# EAGLE design gerbalino0.3.1 (EAGLE 7.4.0)
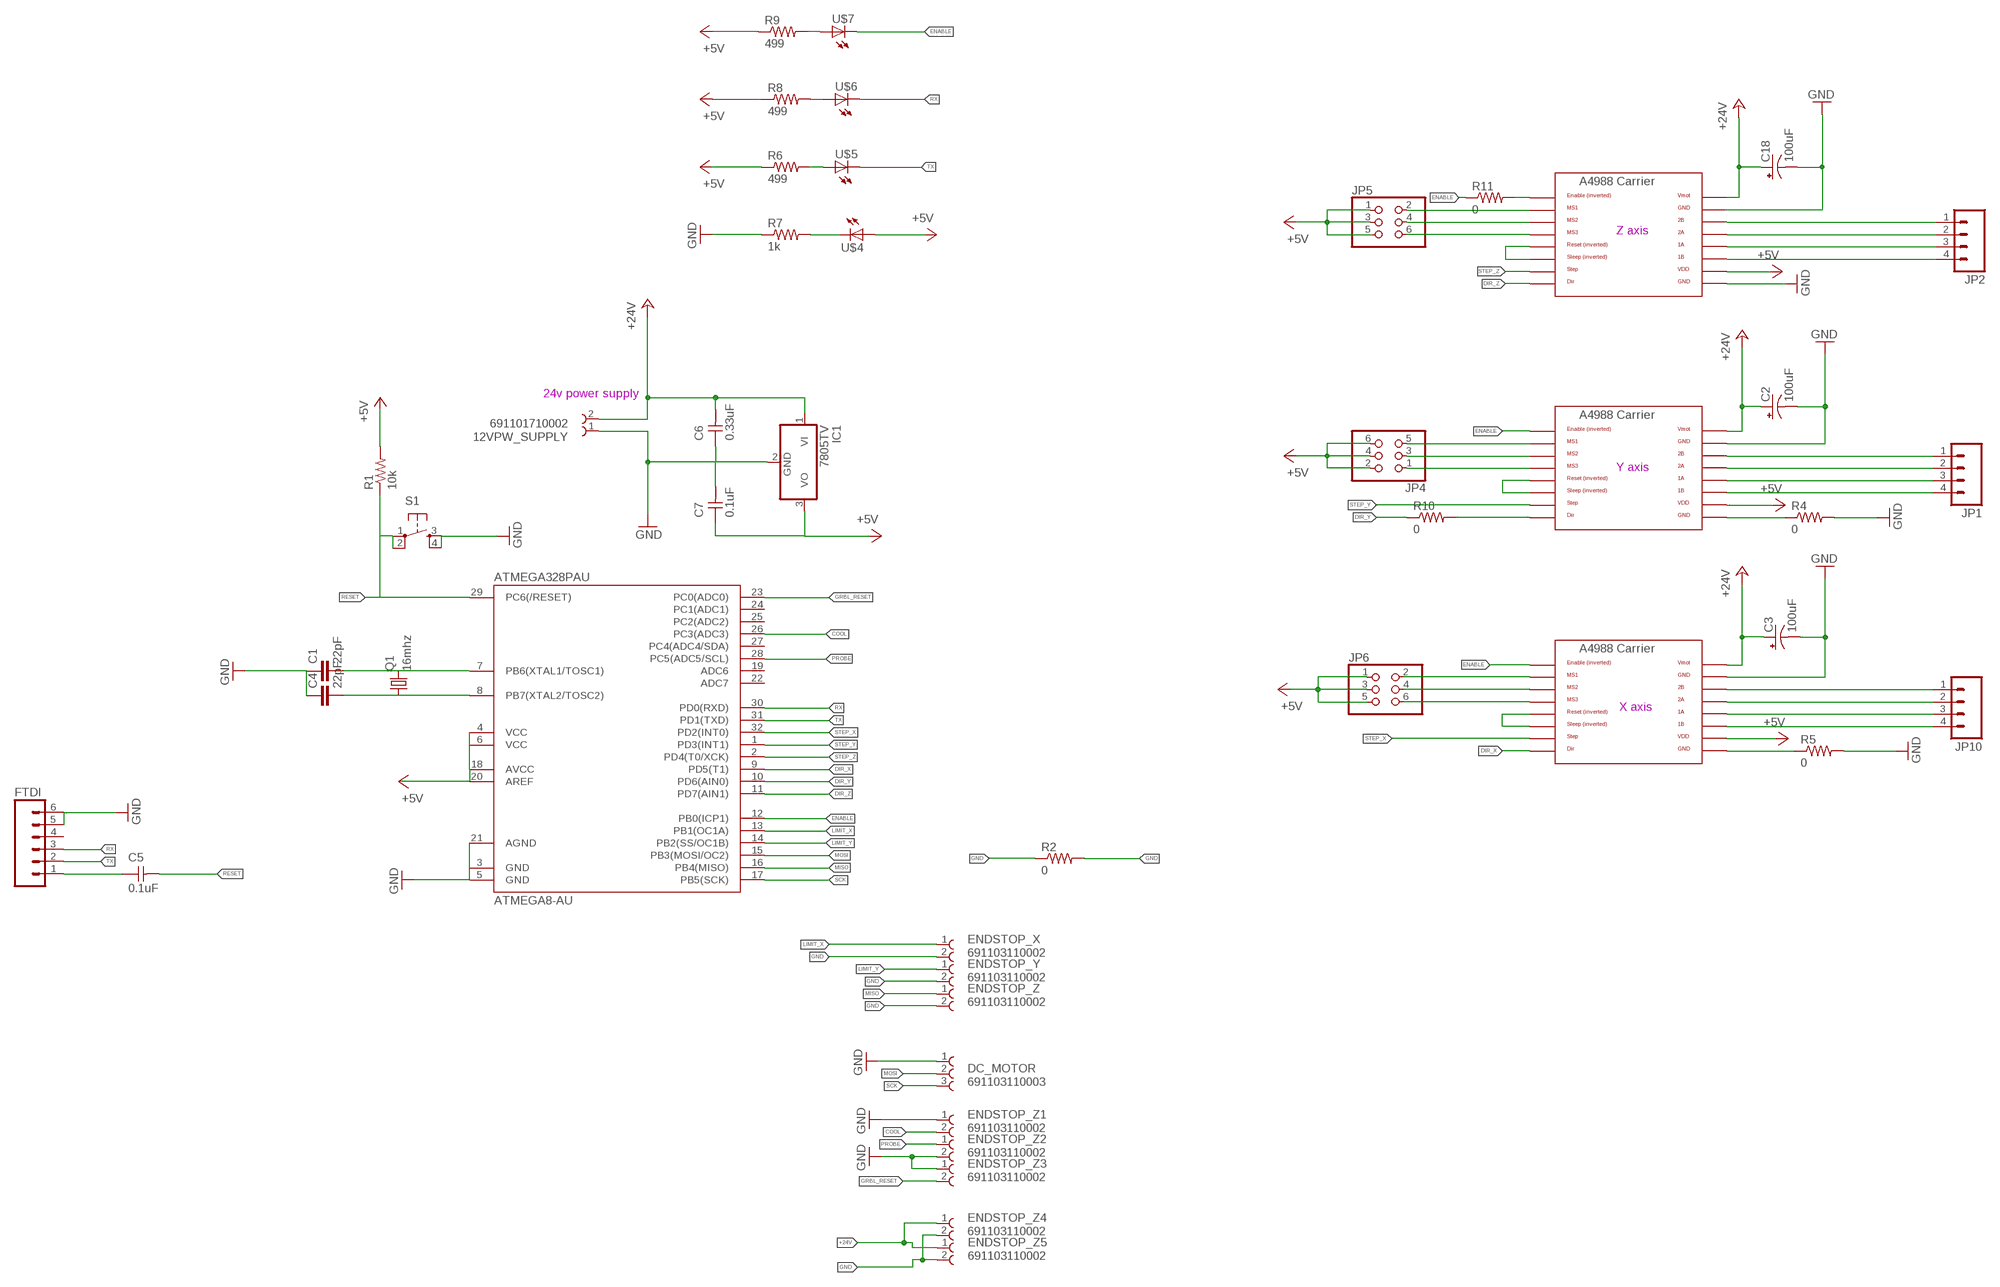
[diagram p0: schematic, sheet 1]

## Parts
12VPW_SUPPLY  691101710002  [691101710002]
ATMEGA328PAU  ATMEGA8-AU  [TQFP32-08]
C1  22pF  CAP1206  [1206]
C2  100uF  CPOL-USUD-10X10  [UD-10X10_NICHICON]
C3  100uF  CPOL-USUD-10X10  [UD-10X10_NICHICON]
C4  22pF  CAP1206  [1206]
C5  0.1uF  UNPOLARIZED_CAPACITOR1206  [1206]
C6  0.33uF  UNPOLARIZED_CAPACITOR1206  [1206]
C7  0.1uF  UNPOLARIZED_CAPACITOR1206  [1206]
C18  100uF  CPOL-USUD-10X10  [UD-10X10_NICHICON]
DC_MOTOR  691103110003  [691103110003]
ENDSTOP_X  691103110002  [691103110002]
ENDSTOP_Y  691103110002  [691103110002]
ENDSTOP_Z  691103110002  [691103110002]
ENDSTOP_Z1  691103110002  [691103110002]
ENDSTOP_Z2  691103110002  [691103110002]
ENDSTOP_Z3  691103110002  [691103110002]
ENDSTOP_Z4  691103110002  [691103110002]
ENDSTOP_Z5  691103110002  [691103110002]
FTDI  M06SMD  [1X06-SMD]
IC1  7805TV  [TO220V]
JP1  M04LONGPADS  [1X04_LONGPADS]
JP2  M04LONGPADS  [1X04_LONGPADS]
JP4  PINHD-2X3-SMD  [2X03SMD]
JP5  PINHD-2X3-SMD  [2X03SMD]
JP6  PINHD-2X3-SMD  [2X03SMD]
JP10  M04LONGPADS  [1X04_LONGPADS]
Q1  16mhz  CSM-7X-DU  [CSM-7X-DU]
R1  10k  RESISTOR1206  [1206]
R2  0  RESISTOR1206  [1206]
R4  0  RESISTOR1206  [1206]
R5  0  RESISTOR1206  [1206]
R6  499  RESISTOR1206  [1206]
R7  1k  RESISTOR1206  [1206]
R8  499  RESISTOR1206  [1206]
R9  499  RESISTOR1206  [1206]
R10  0  RESISTOR1206  [1206]
R11  0  RESISTOR1206  [1206]
S1  6MM_SWITCH6MM_SWITCH  [6MM_SWITCH]
U$1  POLOLU_A4983CARRIER  [A4988BREAKOUT]
U$2  POLOLU_A4983CARRIER  [A4988BREAKOUT]
U$3  POLOLU_A4983CARRIER  [A4988BREAKOUT]
U$4  LED1206  [1206]
U$5  LED1206  [1206]
U$6  LED1206  [1206]
U$7  LED1206  [1206]

## Nets
+5V [power]: ATMEGA328PAU.4(VCC) ATMEGA328PAU.6(VCC) ATMEGA328PAU.18(AVCC) ATMEGA328PAU.20(AREF) C7.1 IC1.3(VO) JP4.2 JP4.4 JP4.6 JP5.1 JP5.3 JP5.5 JP6.1 JP6.3 JP6.5 R1.2 R6.1 R8.1 R9.1 U$1.VDD U$2.VDD U$3.VDD U$4.1(A)
+24V: 12VPW_SUPPLY.2 C2.+ C3.+ C6.2 C18.+ ENDSTOP_Z4.1 ENDSTOP_Z5.1 IC1.1(VI) U$1.VMOT U$2.VMOT U$3.VMOT
COOL: ATMEGA328PAU.26(PC3(ADC3)) ENDSTOP_Z1.2
DIR_X: ATMEGA328PAU.9(PD5(T1)) U$3.DIR
DIR_Y: ATMEGA328PAU.10(PD6(AIN0)) R10.1
DIR_Z: ATMEGA328PAU.11(PD7(AIN1)) U$2.DIR
ENABLE: ATMEGA328PAU.12(PB0(ICP1)) R11.1 R11.2 U$1.EN U$2.EN U$3.EN U$7.2(C)
GND [power]: 12VPW_SUPPLY.1 ATMEGA328PAU.3(GND) ATMEGA328PAU.5(GND) ATMEGA328PAU.21(AGND) C1.1 C2.- C3.- C4.1 C6.1 C7.2 C18.- DC_MOTOR.1 ENDSTOP_X.2 ENDSTOP_Y.2 ENDSTOP_Z1.1 ENDSTOP_Z2.2 ENDSTOP_Z3.1 ENDSTOP_Z4.2 ENDSTOP_Z5.2 ENDSTOP_Z.2 FTDI.5 FTDI.6 IC1.2(GND) R2.1 R2.2 R4.1 R4.2 R5.1 R5.2 R7.1 S1.3(S) S1.4(S1) U$1.GND U$1.GND@0(GND) U$2.GND U$2.GND@0(GND) U$3.GND U$3.GND@0(GND)
GRBL_RESET: ATMEGA328PAU.23(PC0(ADC0)) ENDSTOP_Z3.2
LIMIT_X: ATMEGA328PAU.13(PB1(OC1A)) ENDSTOP_X.1
LIMIT_Y: ATMEGA328PAU.14(PB2(SS/OC1B)) ENDSTOP_Y.1
MISO: ATMEGA328PAU.16(PB4(MISO)) ENDSTOP_Z.1
MOSI: ATMEGA328PAU.15(PB3(MOSI/OC2)) DC_MOTOR.2
N$1: R7.2 U$4.2(C)
N$5: C5.1 FTDI.1
N$7: R8.2 U$6.1(A)
N$9: JP1.1 U$1.2B
N$10: JP1.2 U$1.2A
N$11: JP1.3 U$1.1A
N$12: JP1.4 U$1.1B
N$13: JP10.1 U$3.2B
N$14: JP10.2 U$3.2A
N$15: JP10.3 U$3.1A
N$16: JP10.4 U$3.1B
N$17: JP2.1 U$2.2B
N$18: JP2.2 U$2.2A
N$19: JP2.3 U$2.1A
N$20: JP2.4 U$2.1B
N$21: U$1.RST U$1.SLP(SLEEP)
N$22: U$3.RST U$3.SLP(SLEEP)
N$23: R9.2 U$7.1(A)
N$24: R10.2 U$1.DIR
N$25: R6.2 U$5.1(A)
N$28: U$2.RST U$2.SLP(SLEEP)
N$29: ATMEGA328PAU.8(PB7(XTAL2/TOSC2)) C4.2 Q1.1
N$30: JP5.6 U$2.MS3
N$31: JP5.4 U$2.MS2
N$32: JP5.2 U$2.MS1
N$33: JP4.1 U$1.MS3
N$34: JP4.3 U$1.MS2
N$35: JP4.5 U$1.MS1
N$36: JP6.6 U$3.MS3
N$37: JP6.4 U$3.MS2
N$38: JP6.2 U$3.MS1
N$39: ATMEGA328PAU.7(PB6(XTAL1/TOSC1)) C1.2 Q1.2
PROBE: ATMEGA328PAU.28(PC5(ADC5/SCL)) ENDSTOP_Z2.1
RESET: ATMEGA328PAU.29(PC6(/RESET)) C5.2 R1.1 S1.1(P) S1.2(P1)
RX: ATMEGA328PAU.30(PD0(RXD)) FTDI.3 U$6.2(C)
SCK: ATMEGA328PAU.17(PB5(SCK)) DC_MOTOR.3
STEP_X: ATMEGA328PAU.32(PD2(INT0)) U$3.STEP
STEP_Y: ATMEGA328PAU.1(PD3(INT1)) U$1.STEP
STEP_Z: ATMEGA328PAU.2(PD4(T0/XCK)) U$2.STEP
TX: ATMEGA328PAU.31(PD1(TXD)) FTDI.2 U$5.2(C)
Unconnected: ATMEGA328PAU.19(ADC6) ATMEGA328PAU.22(ADC7) ATMEGA328PAU.24(PC1(ADC1)) ATMEGA328PAU.25(PC2(ADC2)) ATMEGA328PAU.27(PC4(ADC4/SDA)) FTDI.4

## Notes on the sheet
- Z axis
- 24v power supply
- Y axis
- X axis

## Library data of the parts
12VPW_SUPPLY = Wurth_Elektronik_Electromechanic_Terminal_Blocks_Connectors_rev15d:691101710002: WR-TBL Serie 101 - 5.0mm HOrizontal Entry Modular with Pressure Clamp - 2.5mm2 Wires , 2 pins=>Code : Con-TBL_Screw_PressureClamp_691101710002 <http://katalog.we-online.de/media/images/eican/Con-TBL_Screw_PressureClamp_6911017100xx_pf2.jpg> Details see: http://katalog.we-online.de/en/em/691_101_710_0xx Created 2014-06-16, Karrer Zheng 2014 (C) Würth Elektronik
ATMEGA328PAU = 01_atmega8:ATMEGA8
C1 C4 = 01_SparkFun:CAP: Capacitor Standard 0603 ceramic capacitor, and 0.1" leaded capacitor.
C2 C3 C18 = rcl:CPOL-US: POLARIZED CAPACITOR, American symbol
C5-C7 = 01_FAB_Hello:UNPOLARIZED_CAPACITOR: unpolarized_capacitor
DC_MOTOR = Wurth_Elektronik_Electromechanic_Terminal_Blocks_Connectors_rev15d:691103110003: WR-TBL Serie 1031 - 3.5mm Horizontal Entry Modular with Pressure Clamp - 1.5mm2 Wires, 3 Pins=>Code : Con_TBL_Screw_PressureClamp_6911103110003 <http://katalog.we-online.de/media/images/eican/Con_TBL_Screw_PressureClamp_69111031100xx_pf2.jpg> Details see: http://katalog.we-online.de/en/em/691_103_110_0xx Created 2014-06-16, Karrer Zheng 2014 (C) Würth Elektronik
ENDSTOP_X ENDSTOP_Y ENDSTOP_Z ENDSTOP_Z1-ENDSTOP_Z5 = Wurth_Elektronik_Electromechanic_Terminal_Blocks_Connectors_rev15d:691103110002: WR-TBL Serie 1031 - 3.5mm Horizontal Entry Modular with Pressure Clamp - 1.5mm2 Wires, 2 Pins=>Code : Con_TBL_Screw_PressureClamp_6911103110002 <http://katalog.we-online.de/media/images/eican/Con_TBL_Screw_PressureClamp_69111031100xx_pf2.jpg> Details see: http://katalog.we-online.de/en/em/691_103_110_0xx Created 2014-06-16, Karrer Zheng 2014 (C) Würth Elektronik
FTDI = 01_SparkFun:M06: Header 6 Standard 6-pin 0.1" header. Use with straight break away headers (SKU : PRT-00116), right angle break away headers (PRT-00553), swiss pins (PRT-00743), machine pins (PRT-00117), and female headers (PRT-00115). Molex polarized connector foot print use with SKU : PRT-08094 with associated crimp pins and housings. NOTES ON THE VARIANTS LOCK and LOCK_LONGPADS... This footprint was designed to help hold the alignment of a through-hole component (i.e. 6-pin header) while soldering it into place. You may notice that each hole has been shifted either up or down by 0.005 of an inch from it's more standard position (which is a perfectly straight line). This slight alteration caused the pins (the squares in the middle) to touch the edges of the holes. Because they are alternating, it causes a "brace" to hold the component in place. 0.005 has proven to be the perfect amount of "off-center" position when using our standard breakaway headers. Although looks a little odd when you look at the bare footprint, once you have a header in there, the alteration is very hard to notice. Also, if you push a header all the way into place, it is covered up entirely on the bottom side. This idea of altering the position of holes to aid alignment will be further integrated into the Sparkfun Library for other footprints. It can help hold any component with 3 or more connection pins.
IC1 = linear:78*: Positive VOLTAGE REGULATOR Source: http://cache.national.com/ds/LM/LM78L05.pdf http://www.fairchildsemi.com/ds/LM/LM7805.pdf
JP1 JP2 JP10 = 01_SparkFun:M04: Header 4 Standard 4-pin 0.1" header. Use with straight break away headers (SKU : PRT-00116), right angle break away headers (PRT-00553), swiss pins (PRT-00743), machine pins (PRT-00117), and female headers (PRT-00115). Molex polarized connector foot print use with SKU : PRT-08231 with associated crimp pins and housings.
JP4-JP6 = 01_FAB_Hello:PINHD-2X3-SMD: PIN HEADER
Q1 = crystal:CSM-7X-DU: SMD CRYSTAL Source: www.ecsxtal.com .. Crystal 3.6864MHz CSM_7X_DU.PDF; OC_FARNELL: unknown; OC_NEWARK: unknown
R1 R2 R4 R5 R10 R11 = 01_SparkFun:RESISTOR: Resistor Basic schematic elements and footprints for 0603, 1206, and PTH 1/10th watt (small) resistors.
R6-R9 = 01_FAB_Hello:RESISTOR
S1 = 01_FAB_Hello:6MM_SWITCH: OMRON SWITCH
U$1-U$3 = RepRapjr:POLOLU_A4983CARRIER
U$4-U$7 = 01_FAB_Hello:LED

## Net classes
0 default: width 0.203 mm, clearance 0.203 mm
1 power: width 0.305 mm, clearance 0.203 mm

## Board
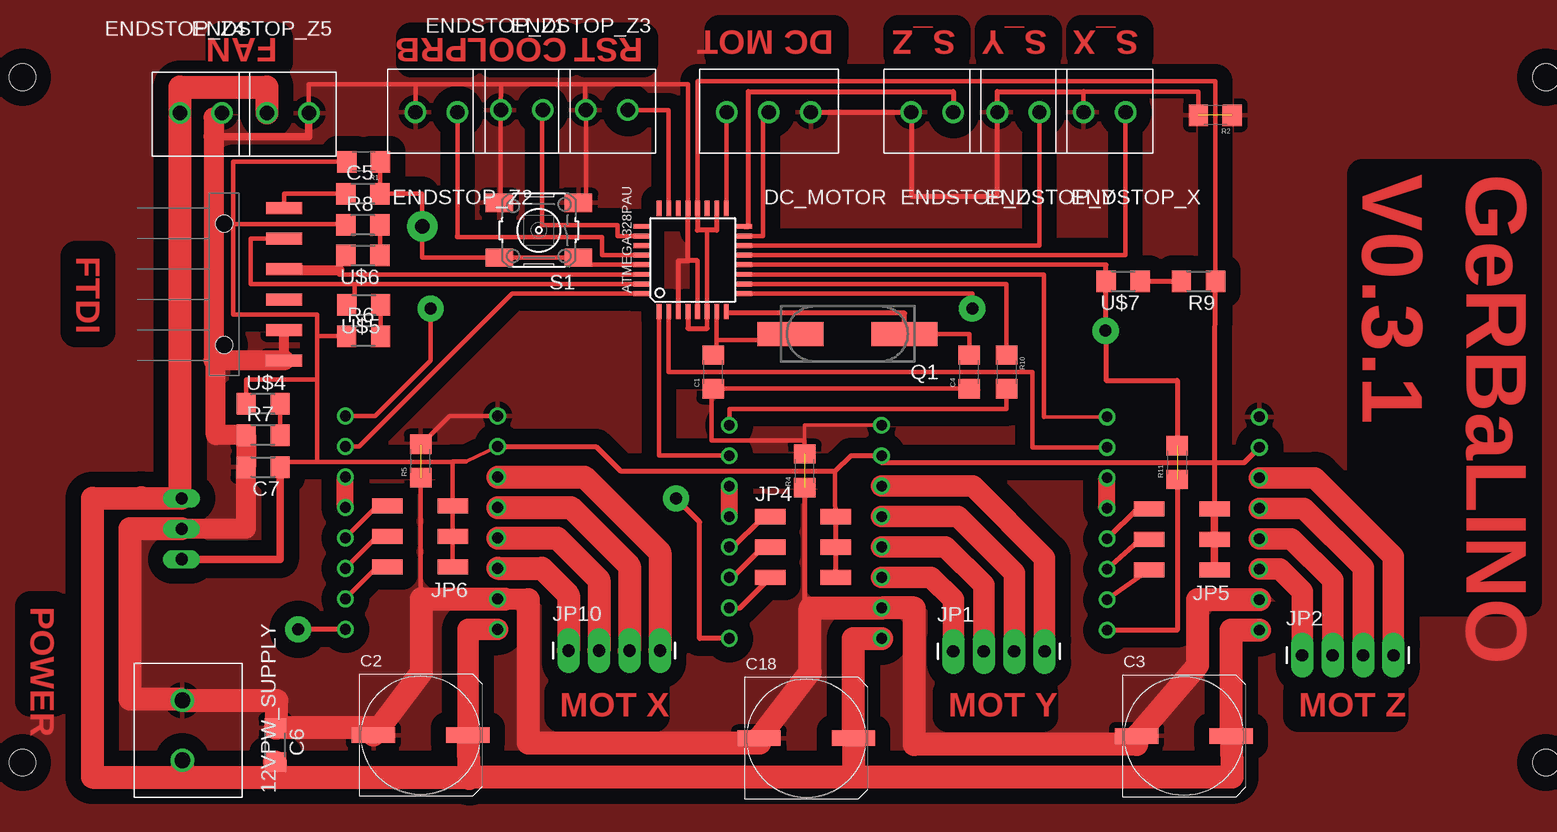
[diagram p1: board, top side]
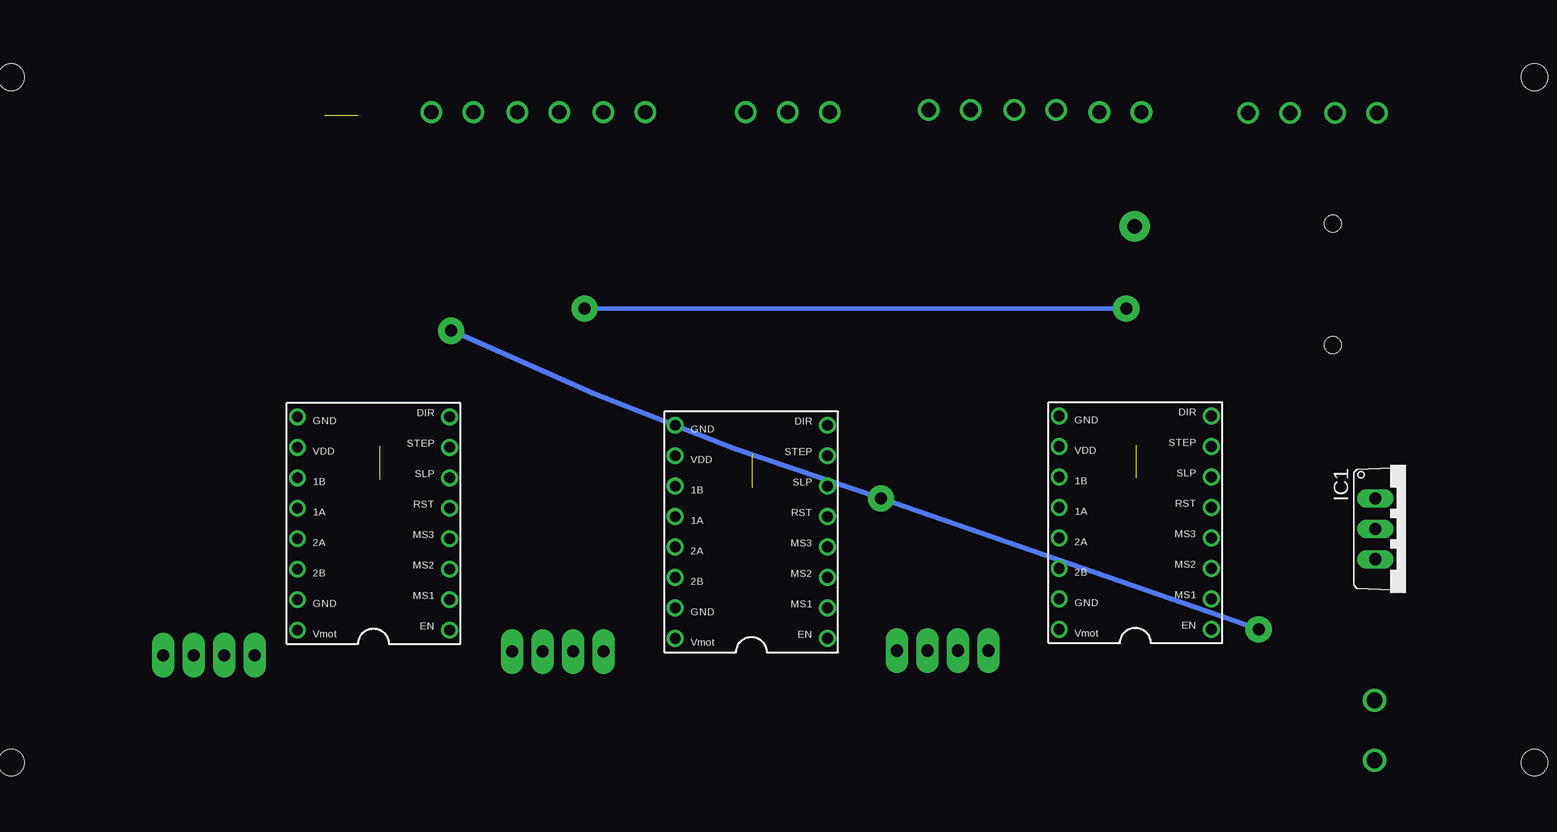
[diagram p2: board, bottom side, seen from below]

No outline drawn. Coordinates in mm, seen from the top.
Copper layers (1*16): Top 0.035mm / dielectric 1.5mm / Bottom 0.035mm
Design rules "default *": minimum track width 8mil, minimum drill 16mil, track to track 8mil, track to pad 8mil, pad to pad 8mil, via to via 8mil, smd to smd 8mil, copper to edge 30mil, drill to drill 10mil, minimum pad ring 10mil, minimum via ring 12mil, stop-mask expansion 4mil, vias tented up to drill 0mil, thermal gap 20mil
Holes 2.2 mm at -12.7,57.15 -12.7,0 114.3,57.15 114.3,0

### Footprints (pad centres in the part's own frame; a part is rotated, then mirrored left to right if it is on the bottom)
691101710002 = drill 1.3: 1 -5,0; 2 0,0
TQFP32-08 = smd 1.27 x 0.406: 1 -4.293,2.8; 2 -4.293,2; 3 -4.293,1.2; 4 -4.293,0.4; 5 -4.293,-0.4; 6 -4.293,-1.2; 7 -4.293,-2; 8 -4.293,-2.8; 17 4.293,-2.8; 18 4.293,-2; 19 4.293,-1.2; 20 4.293,-0.4; 21 4.293,0.4; 22 4.293,1.2; 23 4.293,2; 24 4.293,2.8 | smd 0.406 x 1.27: 9 -2.8,-4.293; 10 -2,-4.293; 11 -1.2,-4.293; 12 -0.4,-4.293; 13 0.4,-4.293; 14 1.2,-4.293; 15 2,-4.293; 16 2.8,-4.293; 25 2.8,4.293; 26 2,4.293; 27 1.2,4.293; 28 0.4,4.293; 29 -0.4,4.293; 30 -1.2,4.293; 31 -2,4.293; 32 -2.8,4.293
1206 = smd 1.6 x 1.8: 1 -1.4,0; 2 1.4,0
UD-10X10_NICHICON = smd 3.6 x 1.3: + 3.925,0; - -3.95,0
1206' = smd 1.6 x 1.803: 1 -1.422,0; 2 1.422,0
691103110003 = drill 1.2: 1 -3.5,0; 2 0,0; 3 3.5,0
691103110002 = drill 1.2: 1 -3.5,0; 2 0,0
1X06-SMD = smd 1 x 3: 1 -6.35,5; 2 -3.81,5; 3 -1.27,5; 4 1.27,5; 5 3.81,5; 6 6.35,5 | hole 1.4: -5.08,0; 5.08,0
TO220V = drill 1.016 long: 1 -2.54,-2.54; 2 0,-2.54; 3 2.54,-2.54
1X04_LONGPADS = drill 1.016 pad 1.88 long: 1 0,0; 2 2.54,0; 3 5.08,0; 4 7.62,0
2X03SMD = smd 2.54 x 1.27: 1 -2.54,2.54; 2 2.92,2.54; 3 -2.54,0; 4 2.92,0; 5 -2.54,-2.54; 6 2.92,-2.54
CSM-7X-DU = smd 5.5 x 2: 1 -4.75,0; 2 4.75,0
6MM_SWITCH = smd 2.286 x 1.524: 1 -3.302,2.286; 2 3.302,2.286; 3 -3.302,-2.286; 4 3.302,-2.286
A4988BREAKOUT = drill 0.9: 1A 8.89,1.27; 1B 11.43,1.27; 2A 6.35,1.27; 2B 3.81,1.27; DIR 16.51,-11.43; EN -1.27,-11.43; GND 16.51,1.27; GND@0 1.27,1.27; MS1 1.27,-11.43; MS2 3.81,-11.43; MS3 6.35,-11.43; RST 8.89,-11.43; SLP 11.43,-11.43; STEP 13.97,-11.43; VDD 13.97,1.27; VMOT -1.27,1.27

### Placement (x,y rotation side)
12VPW_SUPPLY  0.64,0.19 270 top
ATMEGA328PAU  43.18,41.91 90 top
C1  44.89,32.58 90 top
C2  20.51,2.29 0 top
C3  84.14,2.22 0 top
C4  66.23,32.58 90 top
C5  0.1uF  [1206']  15.68,47.43 0 top
C6  0.33uF  [1206']  8.38,1.46 270 top
C7  0.1uF  [1206']  7.37,24.64 180 top
C18  52.65,2.03 0 top
DC_MOTOR  49.53,54.23 180 top
ENDSTOP_X  75.76,54.23 180 top
ENDSTOP_Y  68.58,54.23 180 top
ENDSTOP_Z  61.4,54.23 180 top
ENDSTOP_Z1  30.67,54.42 0 top
ENDSTOP_Z2  20.07,54.23 180 top
ENDSTOP_Z3  37.78,54.42 0 top
ENDSTOP_Z4  3.94,54.17 0 top
ENDSTOP_Z5  11.18,54.17 0 top
FTDI  4.13,39.88 270 top
IC1  -1.97,19.49 270 bottom
JP1  64.9,9.27 0 top
JP2  93.98,8.95 0 top
JP4  52.2,17.97 0 top
JP5  84.14,18.61 180 top
JP6  20.64,18.86 180 top
JP10  32.83,9.33 0 top
Q1  56.07,35.75 180 top
R1  15.75,50.1 180 top
R2  86.74,53.98 180 top
R4  52.51,24.32 90 top
R5  20.51,25.15 90 top
R6  499  [1206']  15.75,35.56 0 top
R7  1k  [1206']  7.37,27.3 0 top
R8  499  [1206']  15.68,44.83 0 top
R9  499  [1206']  85.34,40.13 180 top
R10  69.34,32.58 270 top
R11  83.57,25.02 90 top
S1  30.35,44.39 180 top
U$1  57.66,11.62 90 bottom
U$2  89.15,12.32 90 bottom
U$3  25.65,12.38 90 bottom
U$4  [1206']  7.37,29.91 0 top
U$5  [1206']  15.75,38.16 180 top
U$6  [1206']  15.68,42.29 180 top
U$7  [1206']  79.06,40.13 180 top

### Tracks (layer width: path | path; a pad name or v marks a point on that pad's centre or on a via)
+5V
  Top 0.305: ATMEGA328PAU.6 | 23.05,25.08 24.27,25.12 U$3.VDD
  Top 0.356: 44.38,36.2 ATMEGA328PAU.6 | ATMEGA328PAU.6 44.39,44.39 | ATMEGA328PAU.20 43.58,56.83 86.77,56.83 R9.1 | 11.88,25.09 11.87,29.21 11.87,31.94 | 23.05,25.08 12.39,25.08 11.88,25.09 | 11.87,31.94 11.87,35.56 | 11.87,35.56 11.87,37.34 4.89,37.34 4.89,44.9 | 4.89,44.9 4.89,50.1 R1.2 | JP6.1 JP6.3 JP6.5 23.18,25.12 24.27,25.12 | JP4.2 55.05,21.59 55.05,24.32 | R6.1 11.87,35.56 | R8.1 14.26,44.9 4.89,44.9 | 11.88,25.09 8.79,25.09 C7.1 | U$4.1 5.94,31.94 11.87,31.94
  Top 0.406: JP4.6 JP4.4 JP4.2 | ATMEGA328PAU.4 42.78,36.2 44.38,36.2 | ATMEGA328PAU.18 45.18,44.39 44.39,44.39 43.58,44.39 ATMEGA328PAU.20 | U$3.VDD 35.12,26.35 37.15,24.32 55.05,24.32 56.39,25.59 U$1.VDD 58.93,25.02 86.68,25.02 | 86.68,25.02 89.15,25.02 U$2.VDD | 86.68,25.02 JP5.5 | R9.1 86.7,39.81 86.68,33.08 86.68,25.02
  Top 0.61: JP5.1 JP5.3 JP5.5 | C7.1 8.79,16.95 IC1.3
+24V
  Top 1.778: C2.+ 24.44,11.1 U$3.VMOT | -2.6,22 -2.79,22.07
  Top 1.93: C2.+ 24.56,-1.34 24.45,-1.21 | 56.58,-1.21 C18.+ 56.58,10.35 U$1.VMOT | 56.58,-1.21 24.45,-1.21 | 56.58,-1.21 88.13,-1.21 C3.+ 88.06,11.05 U$2.VMOT | IC1.1 -2.79,22.07 -6.86,22.04 -6.86,-1.21 0.64,-1.21 | 0.64,-1.21 8.45,-1.21 | 8.45,-1.21 24.45,-1.21 | 12VPW_SUPPLY.2 0.64,-1.21 | 8.45,-1.15 8.45,-1.21 | C6.2 8.32,0.04 8.45,-1.21 | IC1.1 0.45,22.04 | ENDSTOP_Z5.1 7.68,56.33 0.44,56.33 ENDSTOP_Z4.1 0.44,22.04 IC1.1
COOL
  Top 0.356: ATMEGA328PAU.26 36.89,43.91 36.89,44.83 30.61,44.83 30.61,54.04 30.67,53.85 ENDSTOP_Z1.2
DIR_X  (via drill 1 pad 2.18)
  Top 0.305: 47.94,39.11 ATMEGA328PAU.9
  Top 0.356: v66.48,37.85 66.48,39.11 ATMEGA328PAU.9 | U$3.DIR 16.7,28.89 21.34,33.53 v21.34,37.85
  Bottom 0.356: v21.34,37.85 v66.48,37.85
DIR_Y
  Top 0.356: ATMEGA328PAU.10 69.34,39.91 R10.1
DIR_Z
  Top 0.305: U$2.DIR 72.45,28.83
  Top 0.356: 72.45,28.83 72.45,40.71 ATMEGA328PAU.11
ENABLE  (via drill 1 pad 2.18)  (1 unrouted)
  Top 0.356: ATMEGA328PAU.12 77.64,41.51
  Top 0.406: U$1.EN 43.75,10.35 43.75,20.07 v41.78,22.04 | U$3.EN v10.29,11.11 | 77.64,36.01 77.64,31.88 83.57,31.88 R11.2 | v77.6,36.01 77.64,36.01 | U$2.EN 83.57,11.05 R11.1 | 77.64,36.01 U$7.2 77.64,41.51
  Bottom 0.406: v10.29,11.11 v41.78,22.04 arc8 v77.6,36.01
GND  (3 unrouted)
  Top 0.305: 42.8,46.2 ATMEGA328PAU.21 | 52.51,26.86 52.51,28.13 U$1.GND | 20.51,26.48 R5.2
  Top 0.356: ATMEGA328PAU.5 43.58,41.85 | 34.23,56.58 27.19,56.58 | 27.19,56.58 20.07,56.58 | ATMEGA328PAU.21 42.78,56.58 34.23,56.58 | 34.23,56.58 34.16,54.17 ENDSTOP_Z3.1 34.28,46.74 S1.3 | 27.43,46.8 S1.4 27.17,46.86 ENDSTOP_Z1.1 27.19,56.58 | 20.07,56.58 11.18,56.58 ENDSTOP_Z5.2 | 20.07,56.58 ENDSTOP_Z2.2 | R4.2 52.51,26.86 44.76,26.86 44.76,31.18 C1.1 C4.1 | 20.57,13.64 20.51,13.64 R5.1 | 20.51,26.48 22.92,28.89 U$3.GND | ENDSTOP_X.2 75.75,55.94 85.34,55.94 85.34,55.88 R2.2
  Top 0.406: 43.58,41.85 42.8,41.85 | ATMEGA328PAU.3 41.98,41.85 42.8,41.85 | 42.8,41.85 42.8,46.2 | 20.56,13.65 20.51,13.65 | R4.1 52.51,12.89 54.42,12.89 | U$2.GND 90.42,28.77 | 75.75,55.94 68.58,55.94 ENDSTOP_Y.2 68.58,47.24 61.4,47.24 ENDSTOP_Z.2 DC_MOTOR.1
  Top 0.61: ENDSTOP_Z4.2 3.24,53.78 | ENDSTOP_Z5.2 11.18,52.2 3.24,52.2
  Top 0.813: FTDI.6 FTDI.5 | 5.97,27.3 R7.1 | 3.24,33.53 3.43,33.53
  Top 1.676: FTDI.6 3.24,33.53 3.24,52.2 3.24,53.78 | IC1.2 5.94,19.49 C7.2 R7.1 3.43,27.3 3.43,33.53
  Top 1.778: U$3.GND@0 27.5,13.64 29.46,13.59
  Top 1.93: 29.46,13.59 29.46,1.65 48.77,1.65 C18.- 52.96,7.55 52.96,12.89 54.42,12.89 U$1.GND@0 61.66,12.89 61.66,1.52 80.19,1.52 C3.- 85.28,8.14 85.28,13.59 U$2.GND@0 | IC1.2 -3.75,19.49 -3.75,5.29 0.45,5.29 12VPW_SUPPLY.1 8.51,5.19 8.51,2.88 C6.1 16.56,2.88 C2.- 20.56,7.56 20.56,13.65 20.57,13.64 27.5,13.64
  pour Top (isolate 1.27): -19.05,63.5 120.65,63.5 120.65,-6.35 -19.05,-6.35
GRBL_RESET
  Top 0.356: ENDSTOP_Z3.2 41.18,54.42 ATMEGA328PAU.23
LIMIT_X
  Top 0.356: ATMEGA328PAU.13 79.25,42.31 ENDSTOP_X.1
LIMIT_Y
  Top 0.356: ATMEGA328PAU.14 72.07,43.11 72.07,44.95 ENDSTOP_Y.1
MISO
  Top 0.406: ENDSTOP_Z.1 64.9,55.94 47.82,55.94 47.82,44.71 ATMEGA328PAU.16
MOSI
  Top 0.356: ATMEGA328PAU.15 49.02,43.91 49.02,54.1 DC_MOTOR.2
N$1
  Top 0.356: R7.2 U$4.2
N$5
  Top 0.356: FTDI.1 9.13,47.43 C5.1
N$7
  Top 0.356: U$6.1 R8.2
N$9
  Top 1.778: U$1.2B 63.06,15.43 64.9,13.59 JP1.1
N$10
  Top 1.778: U$1.2A 64.26,17.97 67.44,14.8 JP1.2
N$11
  Top 1.778: U$1.1A 65.28,20.51 69.98,15.81 JP1.3
N$12
  Top 1.778: U$1.1B 66.55,23.05 72.52,17.08 JP1.4
N$13
  Top 1.93: U$3.2B 30.61,16.19 32.83,13.97 JP10.1
N$14
  Top 1.93: U$3.2A 31.88,18.73 35.37,15.24 JP10.2
N$15
  Top 1.93: U$3.1A 33.02,21.27 37.91,16.38 JP10.3
N$16
  Top 1.93: U$3.1B 34.16,23.81 40.45,17.53 JP10.4
N$17
  Top 1.778: U$2.2B 92.14,16.13 93.98,14.29 JP2.1
N$18
  Top 1.778: U$2.2A 93.09,18.67 96.52,15.24 JP2.2
N$19
  Top 1.778: U$2.1A 94.11,21.21 99.06,16.26 JP2.3
N$20
  Top 1.778: U$2.1B 95.06,23.75 101.6,17.21 JP2.4
N$21
  Top 1.422: U$1.RST U$1.SLP
N$22
  Top 1.422: U$3.RST U$3.SLP
N$23
  Top 0.406: U$7.1 R9.2
N$24
  Top 0.356: U$1.DIR 46.23,29.46 69.34,29.46 R10.2
N$25
  Top 0.356: U$5.1 R6.2
N$28
  Top 1.422: U$2.RST U$2.SLP
N$29
  Top 0.356: 45.98,37.47 ATMEGA328PAU.8 | Q1.1 66.23,35.75 C4.2
  Top 0.406: Q1.1 60.83,37.47 45.98,37.47
N$30
  Top 0.406: U$2.MS3 80.39,21.27 JP5.6
N$31
  Top 0.406: U$2.MS2 80.71,18.8 JP5.4
N$32
  Top 0.406: U$2.MS1 JP5.2
N$33
  Top 0.406: U$1.MS3 46.55,17.97 48.9,20.32 49.47,20.32 JP4.1
N$34
  Top 0.406: U$1.MS2 46.48,15.43 48.83,17.78 49.47,17.78 JP4.3
N$35
  Top 0.406: U$1.MS1 47.12,12.89 JP4.5
N$36
  Top 0.356: U$3.MS3 17.21,21.72 JP6.6
N$37
  Top 0.356: U$3.MS2 17.21,19.18 JP6.4
N$38
  Top 0.356: U$3.MS1 17.21,16.64 JP6.2
N$39
  Top 0.356: 45.18,35.24 ATMEGA328PAU.7 | 45.18,35.24 45.15,34.04 C1.2 | 45.18,35.24 51.32,35.24 Q1.2
PROBE
  Top 0.356: ATMEGA328PAU.28 35.62,42.31 35.62,43.81 23.56,43.81 23.57,44.19 ENDSTOP_Z2.1
RESET  (via drill 1.2 pad 2.54)
  Top 0.356: ATMEGA328PAU.29 33.59,41.51 S1.1 S1.2 20.64,42.1 v20.64,44.7 20.64,47.43 C5.2 17.11,50.04 R1.1
RX
  Top 0.356: ATMEGA328PAU.30 13.72,40.71 13.72,41.08 13.72,42.29 U$6.2
  Top 0.61: FTDI.3 10.52,41.08
  Top 0.813: 10.52,41.08 13.72,41.08
SCK
  Top 0.356: ATMEGA328PAU.17 45.98,54.23 DC_MOTOR.3
STEP_X
  Top 0.356: U$3.STEP 15.37,26.35 28.12,39.11 ATMEGA328PAU.32
STEP_Y
  Top 0.356: ATMEGA328PAU.1 40.39,25.59 U$1.STEP
STEP_Z
  Top 0.356: ATMEGA328PAU.2 41.18,32.58 71.5,32.58 71.5,26.29 U$2.STEP
TX
  Top 0.356: FTDI.2 6.35,43.69 6.35,39.91 14.99,39.91 | 14.99,39.91 ATMEGA328PAU.31 | 14.99,39.91 14.99,38.04 14.33,38.04 U$5.2

### Text on the board
Top: DC MOT | S_Z | S_Y | S_X | FAN | PRB | COOL | RST | GeRBaLINO / V0.3.1 | FTDI | POWER | MOT X | MOT Y | MOT Z